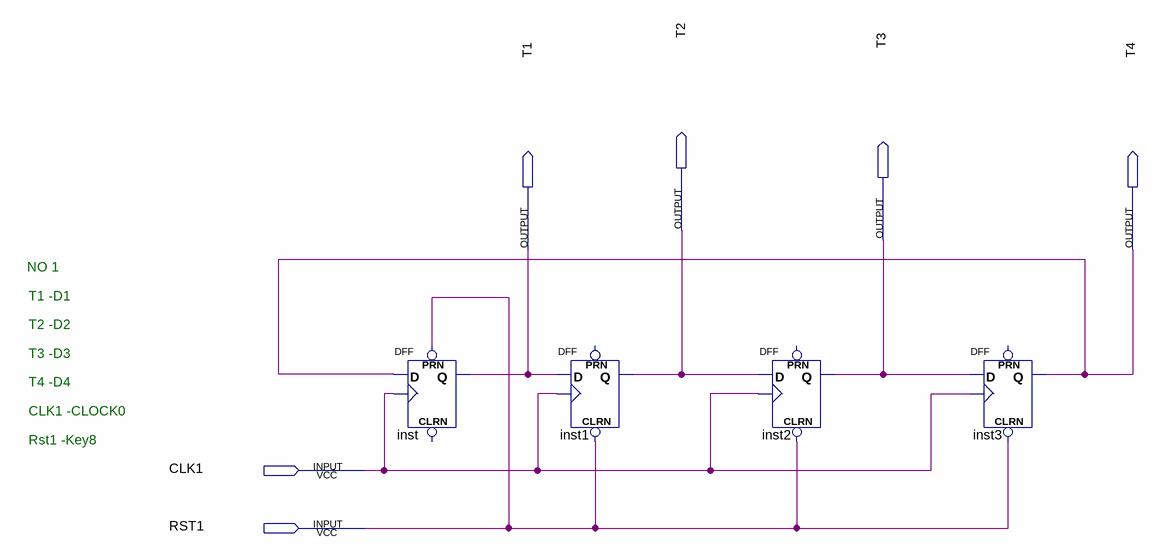
[diagram p0: schematic sheet]
// Quartus schematic exercise1.bdf as structural Verilog: 4 symbols, 6 pins
module exercise1 (
  input  CLK1,
  input  RST1,
  output T2,
  output T3,
  output T1,
  output T4
);

  DFF inst (.CLK(CLK1), .D(T4), .PRN(RST1), .Q(T1));  // open: CLRN
  DFF inst1 (.CLRN(RST1), .CLK(CLK1), .D(T1), .Q(T2));  // open: PRN
  DFF inst2 (.CLRN(RST1), .CLK(CLK1), .D(T2), .Q(T3));  // open: PRN
  DFF inst3 (.CLRN(RST1), .CLK(CLK1), .D(T3), .Q(T4));  // open: PRN

  // Notes on the sheet:
  //     NO 1     
  //   T1 -D1    
  //   T2 -D2    
  //   T3 -D3    
  //   T4 -D4    
  //   CLK1 -CLOCK0    
  //   Rst1 -Key8    
endmodule
